# EAGLE design joystikfix (EAGLE 8.2.0)
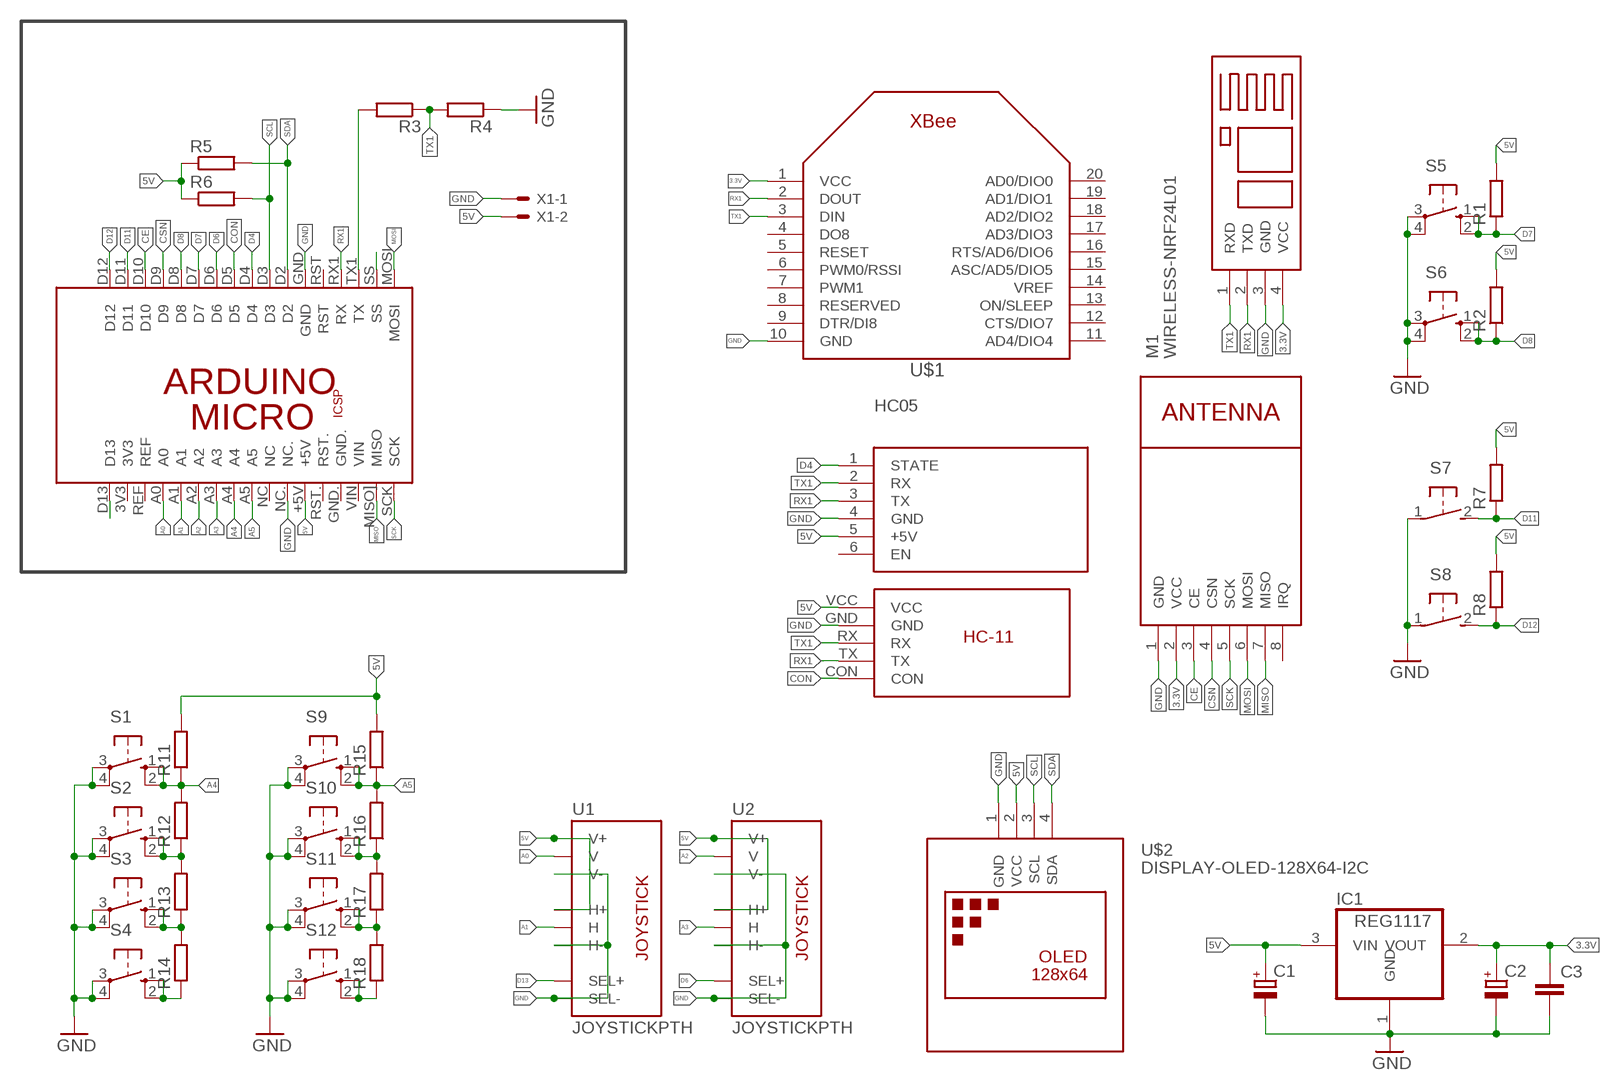
[diagram p0: schematic, sheet 1]

## Parts
C1  CPOL-EUA/3216-18W  [A/3216-18W]
C2  CPOL-EUA/3216-18W  [A/3216-18W]
C3  C-EUC0805K  [C0805K]
HC05  WIRELESS-BLUETOOTH-HC-05  [WIRELESS-BLUETOOTH-HC-05]
HM10  BLUETOOTH  [BLUETOOTH]
IC1  REG1117  [SOT223]
M1  WIRELESS-NRF24L01  [WIRELESS-NRF24L01]
PCB1  ARDUINO_MICRO  [ARDUINO_MICRO]
R1  R-EU_M0805  [M0805]
R2  R-EU_M0805  [M0805]
R3  R-EU_M0805  [M0805]
R4  R-EU_M0805  [M0805]
R5  R-EU_M0805  [M0805]
R6  R-EU_M0805  [M0805]
R7  R-EU_M0805  [M0805]
R8  R-EU_M0805  [M0805]
R11  R-EU_M0805  [M0805]
R12  R-EU_M0805  [M0805]
R13  R-EU_M0805  [M0805]
R14  R-EU_M0805  [M0805]
R15  R-EU_M0805  [M0805]
R16  R-EU_M0805  [M0805]
R17  R-EU_M0805  [M0805]
R18  R-EU_M0805  [M0805]
S1  40-XX  [B3F-40XX]
S2  40-XX  [B3F-40XX]
S3  40-XX  [B3F-40XX]
S4  40-XX  [B3F-40XX]
S5  10-XX  [B3F-10XX]
S6  10-XX  [B3F-10XX]
S7  31-XX  [B3F-31XX]
S8  31-XX  [B3F-31XX]
S9  40-XX  [B3F-40XX]
S10  40-XX  [B3F-40XX]
S11  40-XX  [B3F-40XX]
S12  40-XX  [B3F-40XX]
U1  JOYSTICKPTH  [JOYSTICK]
U2  JOYSTICKPTH  [JOYSTICK]
U$1  XBEE  [XBEE]
U$2  DISPLAY-OLED-128X64-I2C  [DISPLAY-OLED-128X64-I2C]
U$3  HC-11  [HC-11]
X1  22-23-2021  [22-23-2021]

## Nets
3.3V: C2.+ C3.1 HM10.4(VCC) IC1.2(VOUT) M1.2(VCC) U$1.1(VCC)
5V: C1.+ HC05.5(+5V) IC1.3(VIN) PCB1.+5V R1.2 R2.2 R5.1 R6.1 R7.2 R8.2 R11.2 R15.2 U1.H1(H+) U1.V1(V+) U2.H1(H+) U2.V1(V+) U$2.2(VCC) U$3.VCC X1.2
A0: PCB1.A0 U1.V2(V)
A1: PCB1.A1 U1.H2(H)
A2: PCB1.A2 U2.V2(V)
A3: PCB1.A3 U2.H2(H)
A4: PCB1.A4 R11.1 R12.2 S1.1(S) S1.2(S1)
A5: PCB1.A5 R15.1 R16.2 S9.1(S) S9.2(S1)
CE: M1.3(CE) PCB1.D10
CON: PCB1.D5 U$3.CON
CSN: M1.4(CSN) PCB1.D9
D4: HC05.1(STATE) PCB1.D4
D6: PCB1.D6 U2.B1A(SEL+)
D7: PCB1.D7 R1.1 S5.1(S) S5.2(S1)
D8: PCB1.D8 R2.1 S6.1(S) S6.2(S1)
D11: PCB1.D11 R7.1 S7.2(S)
D12: PCB1.D12 R8.1 S8.2(S)
D13: PCB1.D13 U1.B1A(SEL+)
GND: C1.- C2.- C3.2 HC05.4(GND) HM10.3(GND) IC1.1(GND) M1.1(GND) PCB1.GND PCB1.NC. R4.1 S1.3(P) S1.4(P1) S2.3(P) S2.4(P1) S3.3(P) S3.4(P1) S4.3(P) S4.4(P1) S5.3(P) S5.4(P1) S6.3(P) S6.4(P1) S7.1(P) S8.1(P) S9.3(P) S9.4(P1) S10.3(P) S10.4(P1) S11.3(P) S11.4(P1) S12.3(P) S12.4(P1) U1.B2A(SEL-) U1.H3(H-) U1.V3(V-) U2.B2A(SEL-) U2.H3(H-) U2.V3(V-) U$1.10(GND) U$2.1(GND) U$3.GND X1.1
MISO: M1.7(MISO) PCB1.MISO](MISO)
MOSI: M1.6(MOSI) PCB1.MOSI
N$1: PCB1.TX1(TX) R3.2
N$5: PCB1.SS
N$16: R12.1 R13.2 S2.1(S) S2.2(S1)
N$17: R13.1 R14.2 S3.1(S) S3.2(S1)
N$25: R14.1 S4.1(S) S4.2(S1)
N$27: R16.1 R17.2 S10.1(S) S10.2(S1)
N$28: R17.1 R18.2 S11.1(S) S11.2(S1)
N$29: R18.1 S12.1(S) S12.2(S1)
RX1: HC05.3(TX) HM10.2(TXD) PCB1.RX1(RX) U$1.2(DOUT) U$3.TX
SCK: M1.5(SCK) PCB1.SCK
SCL: PCB1.D3 R6.2 U$2.3(SCL)
SDA: PCB1.D2 R5.2 U$2.4(SDA)
TX1: HC05.2(RX) HM10.1(RXD) R3.1 R4.2 U$1.3(DIN) U$3.RX
Unconnected: HC05.6(EN) M1.8(IRQ) PCB1.3V3 PCB1.GND. PCB1.NC PCB1.REF PCB1.RST PCB1.RST. PCB1.VIN U$1.4(DO8) U$1.5(RESET) U$1.6(PWM0/RSSI) U$1.7(PWM1) U$1.8(RESERVED) U$1.9(DTR/DI8) U$1.11(AD4/DIO4) U$1.12(CTS/DIO7) U$1.13(ON/SLEEP) U$1.14(VREF) U$1.15(ASC/AD5/DIO5) U$1.16(RTS/AD6/DIO6) U$1.17(AD3/DIO3) U$1.18(AD2/DIO2) U$1.19(AD1/DIO1) U$1.20(AD0/DIO0)

## Library data of the parts
C1 C2 = rcl:CPOL-EU: POLARIZED CAPACITOR, European symbol
C3 = rcl:C-EU: CAPACITOR, European symbol
HC05 = diy-modules:WIRELESS-BLUETOOTH-HC-05: Bluetooth Transceiver Module based on HC-05 board Tutorial is available here: https://arduino-info.wikispaces.com/BlueTooth-HC05-HC06-Modules-How-To Click here to find device on ebay.com <http://www.ebay.com/sch/hc-05+module+rs232>
HM10 = Bluetooth:BLUETOOTH
IC1 = burr-brown:REG1117: 800mA and 1A Low Dropout (LDO) Positive Regulator 1.8V, 2.5V, 2.85V, 3.3V, 5V, and Adj; MPN: REG1117; OC_FARNELL: 1097566; OC_NEWARK: 14P6981
M1 = diy-modules:WIRELESS-NRF24L01: 2.4 GHz Wireless Module based on NRF24L01 chip More details available here: http://www.electrodragon.com/w/NRF24L01 Click here to find device on ebay.com <http://www.ebay.com/sch/nrf24l01+arduino>
PCB1 = E14_Arduino_revC:ARDUINO_MICRO: Device for representing an Arduino Micro board with a footprint in an EAGLE design. Created by Dave Young for Element14. More EAGLE documentation at: http://www.element14.com/community/community/knode/cadsoft_eagle
R1-R8 R11-R18 = rcl:R-EU_: RESISTOR, European symbol
S1-S4 S9-S12 = switch-omron:40-XX: OMRON SWITCH; MF: OMRON COMPONENTS USA; MPN: B3F-4000; OC_FARNELL: 176434; OC_NEWARK: 36K3105
S5 S6 = switch-omron:10-XX: OMRON SWITCH; MPN: B3F-1000; OC_FARNELL: 176432; OC_NEWARK: 36M3542
S7 S8 = switch-omron:31-XX: OMRON SWITCH; MPN: B3F-3100; OC_FARNELL: 959704; OC_NEWARK: 36M3582
U1 U2 = adafruit:JOYSTICK: Thumb Joystick Joystick commonly found in PS2 controllers. Two pots and a select switch. Adapted from Sparkfun Library (but for more common 6mm switch sticks)
U$1 = adafruit:XBEE
U$2 = diy-modules:DISPLAY-OLED-128X64-I2C: 128x64 Dot Matrix OLED Module based on SSD1306 chip Variant with I2C interface More details available here: http://www.instructables.com/id/Monochrome-096-i2c-OLED-display-with-arduino-SSD13/ SSD1306 datasheet: https://cdn-shop.adafruit.com/datasheets/SSD1306.pdf Click here to find device on ebay.com <http://www.ebay.com/sch/oled+display+128x64+iic> Note: There are two variants: I2C and SPI. Search for the proper version.
U$3 = HC-11:HC-11
X1 = con-molex:22-23-2021: .100" (2.54mm) Center Header - 2 Pin; MF: MOLEX; MPN: 22-23-2021; OC_FARNELL: 1462926; OC_NEWARK: 25C3832

## Board
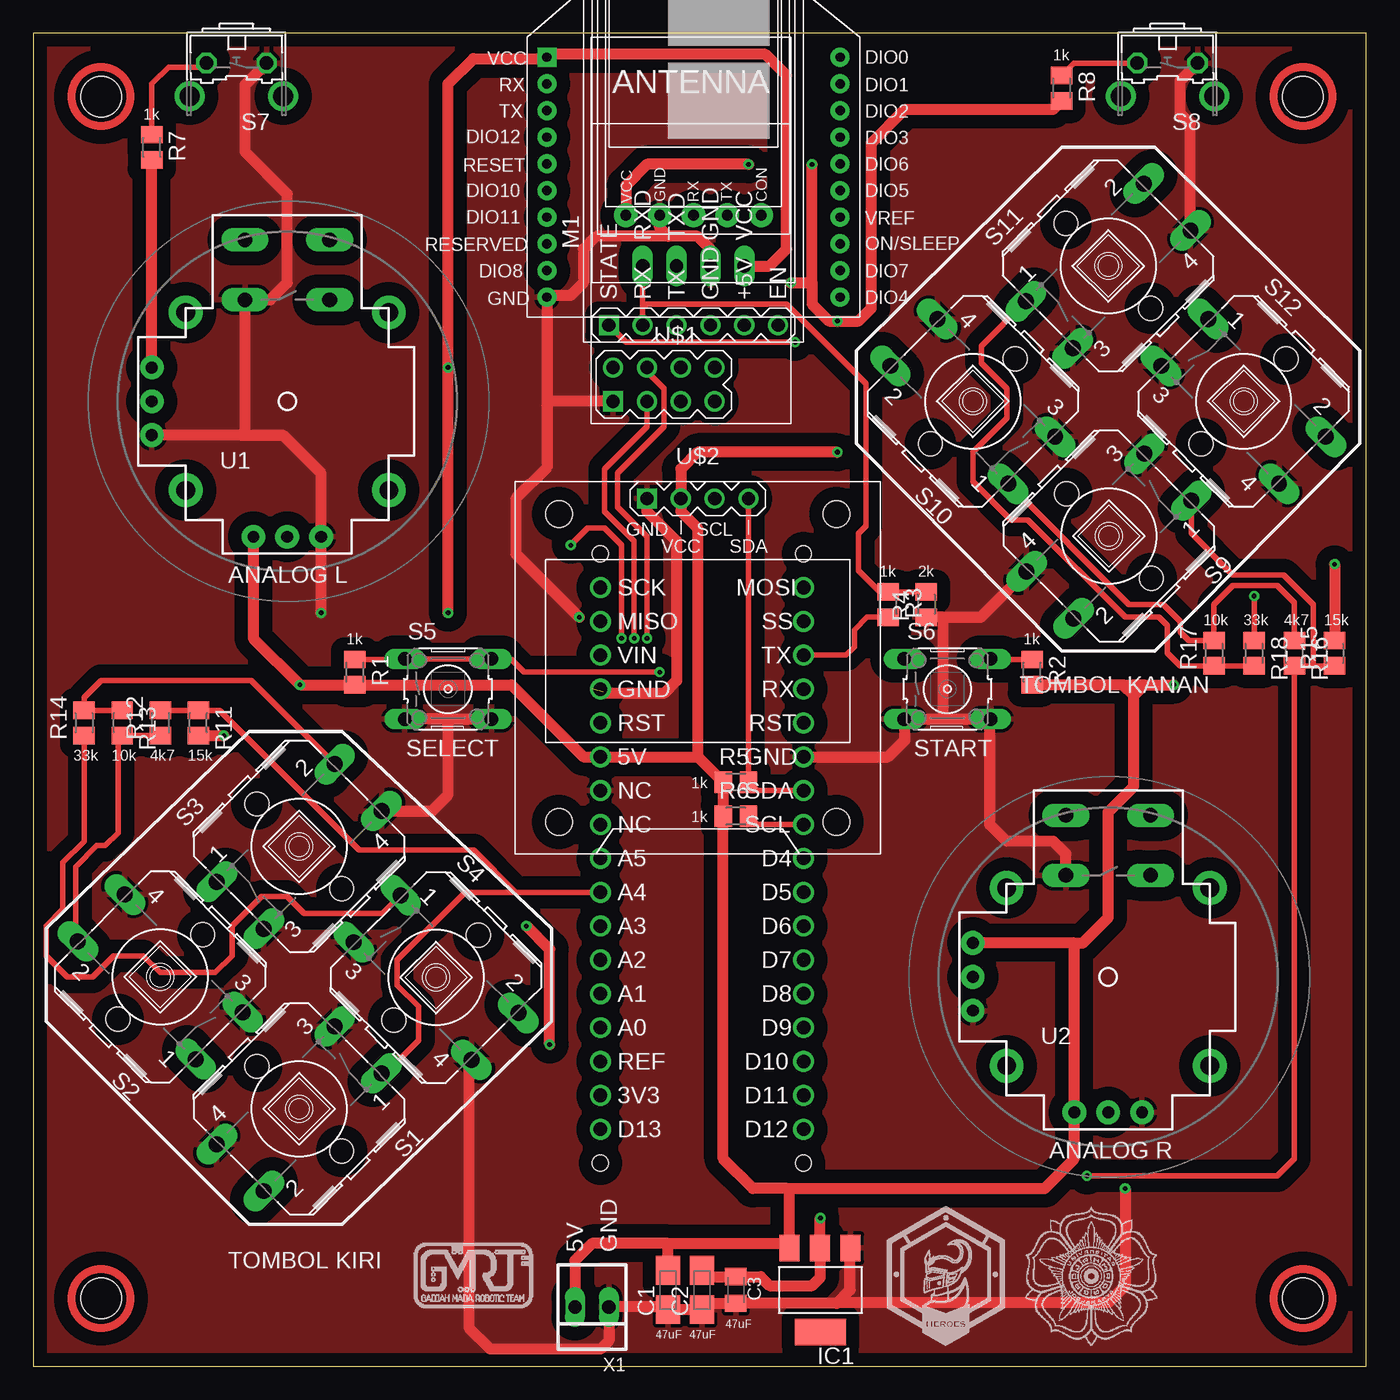
[diagram p1: board, top side]
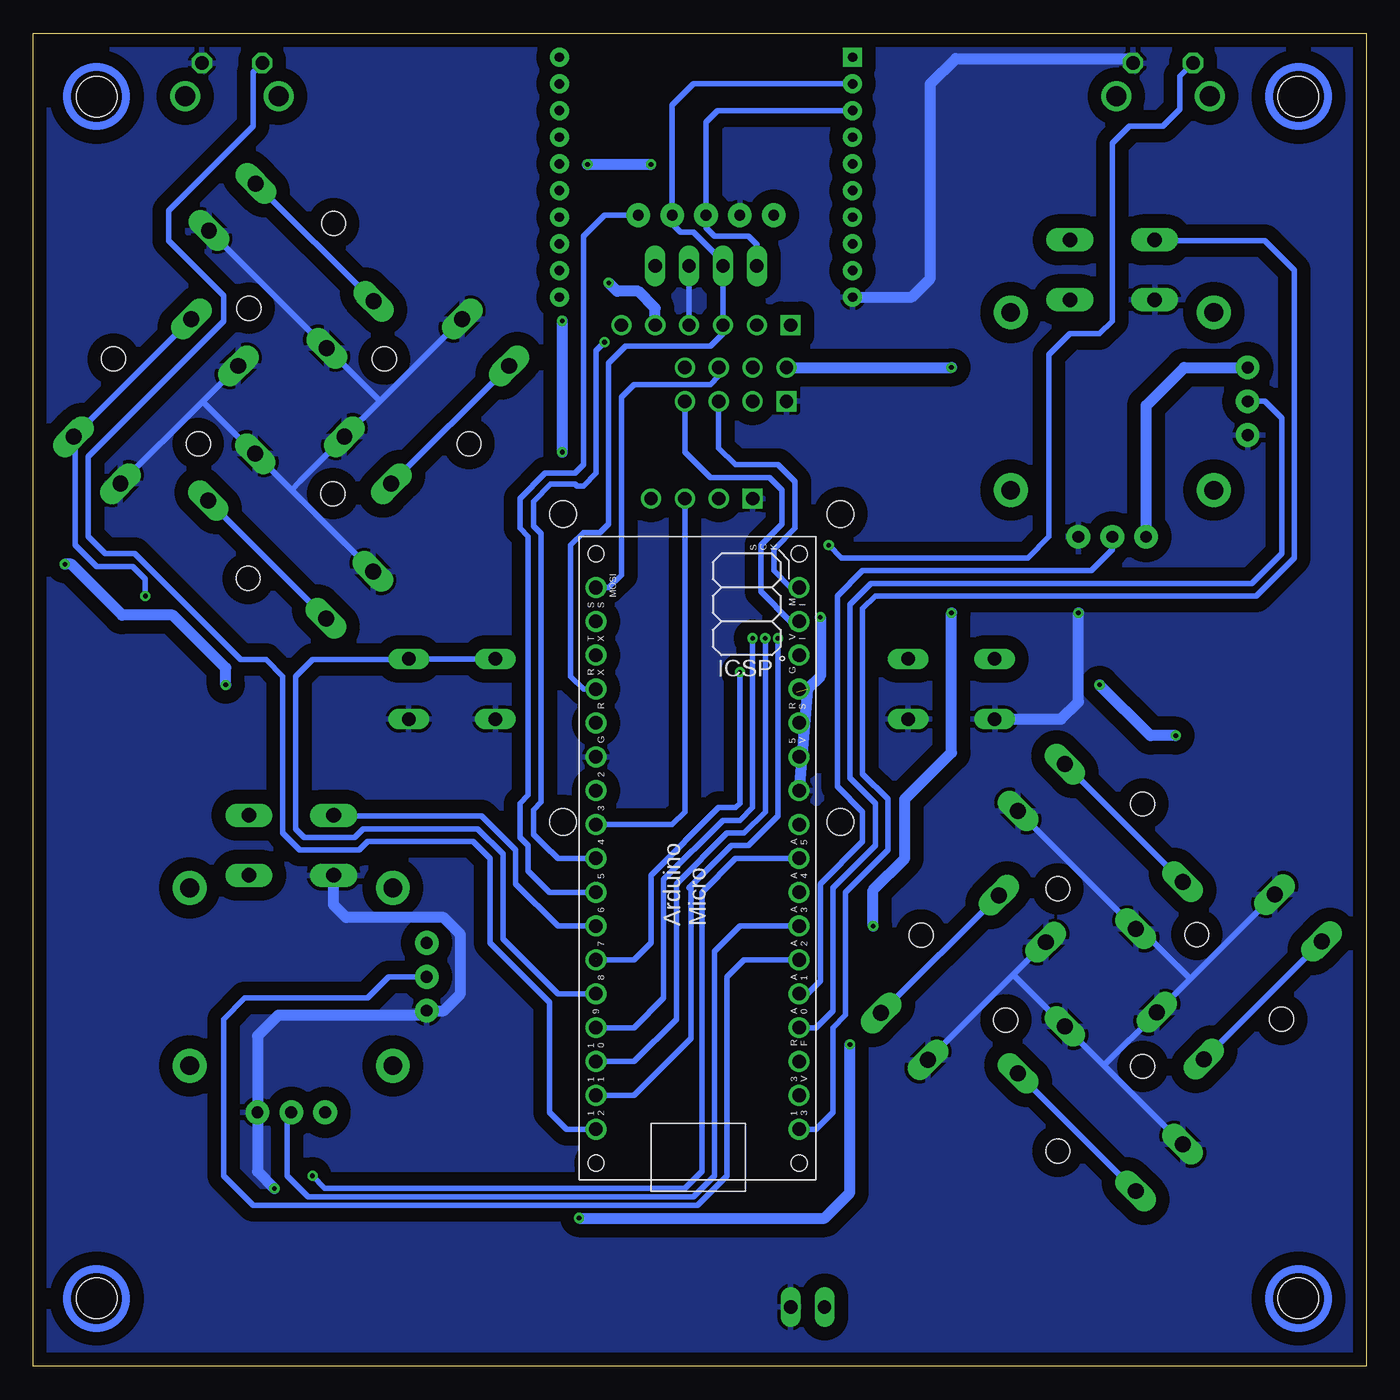
[diagram p2: board, bottom side, seen from below]

Size 100 x 100 mm. Coordinates in mm from the lower left corner, seen from the top.
Outline: 0,0 100,0 100,100 0,100 0,0
Copper layers (1*16): Top 0.035mm / dielectric 1.5mm / Bottom 0.035mm
Design rules "default": minimum track width 6mil, minimum drill 0.35mm, track to track 6mil, track to pad 6mil, pad to pad 6mil, via to via 6mil, smd to smd 6mil, copper to edge 40mil, drill to drill 6mil, minimum pad ring 10mil, minimum via ring 8mil, stop-mask expansion 4mil, vias tented up to drill 0mil, thermal gap 10mil

### Footprints (pad centres in the part's own frame; a part is rotated, then mirrored left to right if it is on the bottom)
A/3216-18W = smd 2.15 x 1.8: + 1.475,0; - -1.475,0
C0805K = smd 1.3 x 1.6: 1 -1,0; 2 1,0
WIRELESS-BLUETOOTH-HC-05 = drill 1 square: 1 -6.35,-17.145 | drill 1: 2 -3.81,-17.145; 3 -1.27,-17.145; 4 1.27,-17.145; 5 3.81,-17.145; 6 6.35,-17.145
BLUETOOTH = drill 1 pad 1.549 long: 1 -6.35,3.81; 2 -6.35,1.27; 3 -6.35,-1.27; 4 -6.35,-3.81
SOT223 = smd 1.499 x 2.007: 1 -2.261,-3.15; 2 0.025,-3.15; 3 2.311,-3.15 | smd 3.81 x 2.007: 4 0,3.15
WIRELESS-NRF24L01 = drill 1 square: 1 -12.7,6.35 | drill 1: 2 -10.16,6.35; 3 -12.7,3.81; 4 -10.16,3.81; 5 -12.7,1.27; 6 -10.16,1.27; 7 -12.7,-1.27; 8 -10.16,-1.27
ARDUINO_MICRO = drill 1.016 pad 1.575: 3V3 6.35,1.27; +5V 31.75,1.27; A0 11.43,1.27; A1 13.97,1.27; A2 16.51,1.27; A3 19.05,1.27; A4 21.59,1.27; A5 24.13,1.27; D2 29.21,16.51; D3 26.67,16.51; D4 24.13,16.51; D5 21.59,16.51; D6 19.05,16.51; D7 16.51,16.51; D8 13.97,16.51; D9 11.43,16.51; D10 8.89,16.51; D11 6.35,16.51; D12 3.81,16.51; D13 3.81,1.27; GND 31.75,16.51; GND. 36.83,1.27; MISO] 41.91,1.27; MOSI 44.45,16.51; NC 26.67,1.27; NC. 29.21,1.27; REF 8.89,1.27; RST 34.29,16.51; RST. 34.29,1.27; RX1 36.83,16.51; SCK 44.45,1.27; SS 41.91,16.51; TX1 39.37,16.51; VIN 39.37,1.27 | hole 1.2: 1.27,1.27; 1.27,16.51; 46.99,16.51; 46.99,1.27
M0805 = smd 1.3 x 1.6: 1 -0.95,0; 2 0.95,0
B3F-40XX = drill 1.194 long: 1 -6.248,2.489; 2 6.248,2.489; 3 -6.248,-2.489; 4 6.248,-2.489 | hole 1.803: 0,-4.496; 0,4.496
B3F-10XX = drill 1.016 long: 1 -3.251,2.261; 2 3.251,2.261; 3 -3.251,-2.261; 4 3.251,-2.261
B3F-31XX = drill 1.016 octagon: 1 -2.261,-1.245; 2 2.261,-1.245 | drill 1.499 pad 2.159: 3 -3.505,1.245; 4 3.505,1.245
JOYSTICK = drill 1.1 pad 1.778 long: B1A -3.175,12.12; B1B 3.175,12.12; B2A -3.175,7.62; B2B 3.175,7.62 | drill 0.889 pad 1.778: H1 -2.54,-10.16; H2 0,-10.16; H3 2.54,-10.16; V1 -10.16,2.54; V2 -10.16,0; V3 -10.16,-2.54 | drill 1.397 pad 2.54: MOUNT1 -7.62,6.668; MOUNT2 -7.62,-6.668; MOUNT3 7.62,-6.668; MOUNT4 7.62,6.668
XBEE = drill 0.7 pad 1.422 square: 1 -11,5.5 | drill 0.7 pad 1.422: 2 -11,3.5; 3 -11,1.5; 4 -11,-0.5; 5 -11,-2.5; 6 -11,-4.5; 7 -11,-6.5; 8 -11,-8.5; 9 -11,-10.5; 10 -11,-12.5; 11 11,-12.5; 12 11,-10.5; 13 11,-8.5; 14 11,-6.5; 15 11,-4.5; 16 11,-2.5; 17 11,-0.5; 18 11,1.5; 19 11,3.5; 20 11,5.5
DISPLAY-OLED-128X64-I2C = drill 1 square: 1 -3.81,12.7 | drill 1: 2 -1.27,12.7; 3 1.27,12.7; 4 3.81,12.7 | hole 2: -10.414,11.557; 10.414,11.557; 10.414,-11.557; -10.414,-11.557
HC-11 = drill 0.8 pad 1.778: CON -17.78,-5.08; GND -17.78,2.54; RX -17.78,0; TX -17.78,-2.54; VCC -17.78,5.08
HOLE-3MM = hole 3.05: 0,0
22-23-2021 = drill 1 long: 1 -1.27,0; 2 1.27,0

### Placement (x,y rotation side)
C1  47.62,5.71 90 top
C2  50.16,5.71 90 top
C3  52.7,5.71 270 top
HC05  49.53,95.25 0 top
HM10  49.53,88.9 90 top
IC1  59.05,5.71 180 top
M1  49.85,85.09 90 top
PCB1  41.27,13.97 90 bottom
R1  24.13,52.07 270 top
R2  74.93,52.07 270 top
R3  64.14,57.15 270 top
R4  66.99,57.15 90 top
R5  52.7,43.81 0 top
R6  52.7,41.27 0 top
R7  8.89,91.44 270 top
R8  77.15,95.89 270 top
R11  12.38,48.26 270 top
R12  9.53,48.26 90 top
R13  6.67,48.26 270 top
R14  3.81,48.26 90 top
R15  97.63,53.5 90 top
R16  94.61,53.5 270 top
R17  88.58,53.5 90 top
R18  91.6,53.5 270 top
S1  19.95,19.31 225 top
S2  9.53,29.21 135 top
S3  19.95,39 45 top
S4  30.22,29.16 315 top
S5  31.12,50.8 0 top
S6  68.58,50.8 0 top
S7  15.24,96.52 180 top
S8  85.09,96.52 180 top
S9  80.7,62.28 225 top
S10  70.48,72.39 135 top
S11  80.64,82.55 45 top
S12  90.81,72.39 315 top
U1  19.05,72.39 0 top
U2  80.64,29.21 0 top
U$1  49.53,92.71 0 top
U$2  49.85,52.39 0 top
U$3  49.53,104.14 90 top
U$4  [HOLE-3MM]  5.08,95.25 0 top
U$5  [HOLE-3MM]  5.08,5.08 0 top
U$6  [HOLE-3MM]  95.25,5.08 0 top
U$7  [HOLE-3MM]  95.25,95.25 0 top
X1  41.91,4.45 180 top

### Tracks (layer width: path | path; a pad name or v marks a point on that pad's centre or on a via)
3.3V  (via drill 0.35)
  Top 0.813: C2.+ 50.64,6.71 C3.1 54.56,6.71 55.25,6.03 58.42,6.03 59.06,6.67 59.06,8.84 IC1.2 59.03,11.09 v59.06,11.11 | v31.12,56.52 v31.12,74.93 31.12,96.2 33.02,98.11 38.43,98.11 U$1.1 38.75,98.42 54.93,98.42 56.52,96.84 56.52,83.82 55.25,82.55 HM10.4 | v38.74,24.13 38.74,31.27 v36.99,33.02
  Bottom 0.813: v59.06,11.11 40.64,11.11 38.74,13.02 v38.74,24.13 | v31.12,56.52 31.12,46.04 34.61,42.55 34.61,38.1 36.99,35.72 v36.99,33.02 | M1.2 v31.12,74.93
5V  (via drill 0.35)
  Top 0.813: 47.51,7.3 C1.+ 47.63,9.21 | X1.2 40.64,7.94 41.91,9.21 47.63,9.21 | 47.63,9.21 56.4,9.21 IC1.3 56.74,13.13 56.54,13.34 | 56.54,13.34 53.98,13.34 51.75,15.56 R6.1 R5.1 49.85,45.72 | 56.54,13.34 75.88,13.34 78.11,15.56 U2.H1 78.11,31.75 | 78.11,31.75 U2.V1 | 78.11,31.75 78.74,31.75 80.65,33.66 80.65,41.59 82.55,43.5 82.55,50.32 | R2.2 81.76,51.12 | 49.85,45.72 PCB1.+5V 41.28,45.72 35.88,51.12 R1.2 v20,51.12 16.51,54.61 U1.H1 | U1.V1 R7.2 | U$3.VCC 44.45,88.58 46.04,90.17 v53.66,90.17 | R11.2 13.65,47.31 | 13.65,47.31 | 49.85,45.72 49.85,62.86 48.58,64.14 U$2.2 48.58,67.31 49.85,68.58 v60.33,68.58 | 58.42,81.28 v58.42,90.17 | 58.42,81.28 58.42,79.69 59.69,78.42 v60.33,78.42 61.91,78.42 62.87,79.38 62.87,91.76 65.41,94.3 76.52,94.3 R8.2 | v56.83,81.28 58.42,81.28 | 13.65,47.31 v14.29,47.31 | 82.55,50.32 82.55,51.12 | 81.76,51.12 82.55,51.12 | 83.34,51.12 82.55,51.12 | 83.34,51.12 v85.57,51.12 | v97.63,60.17 R15.2 | 82.55,50.32 83.34,51.12 | 82.55,50.32 81.76,51.12
  Bottom 0.813: U1.H1 16.51,72.07 13.65,74.93 U1.V1 | HC05.5 53.34,79.38 54.61,80.64 56.2,80.64 v56.83,81.28 | v60.33,78.42 v60.33,68.58 | v58.42,90.17 v53.66,90.17 | v14.29,47.31 16.19,47.31 v20,51.12 | v85.57,51.12 85.57,52.39 89.54,56.36 93.35,56.36 97.16,60.17 v97.63,60.17
A0
  Bottom 0.406: U1.V2 7.62,72.39 6.35,71.12 6.35,60.96 8.57,58.74 37.15,58.74 38.74,57.15 38.74,44.13 36.83,42.23 36.83,39.05 40.01,35.88 40.01,26.67 41.28,25.4 PCB1.A0
A1
  Bottom 0.406: U1.H2 19.05,61.28 20.64,59.69 37.78,59.69 39.69,57.78 39.69,43.5 37.78,41.59 37.78,39.37 40.96,36.2 40.96,28.89 41.91,27.94 PCB1.A1
A2
  Bottom 0.406: PCB1.A2 46.67,30.48 47.94,29.21 47.94,14.29 50.17,12.06 83.5,12.06 85.73,14.29 85.73,26.04 84.14,27.62 74.93,27.62 73.34,29.21 U2.V2
A3
  Bottom 0.406: U2.H2 80.96,18.73 80.96,14.29 79.38,12.7 50.48,12.7 48.9,14.29 48.9,31.11 46.99,33.02 PCB1.A3
A4
  Top 0.406: R12.2 R11.1 13.97,49.21 24.45,38.73 33.02,38.73 36.2,35.56 | 36.2,35.56 PCB1.A4 | 36.2,35.56 32.39,35.56 27.31,30.48 27.31,28.57 28.89,26.99 28.89,24.45 27.62,23.18 27.33,23.18 S1.1
  Bottom 0.406: S1.1 S1.2
A5  (via drill 0.35)
  Top 0.406: v79.06,14.29 93.35,14.29 94.62,15.56 R16.2 95.89,52.55 | 95.89,52.55 R15.1 | S9.1 86.88,62.51 90.01,59.37 93.82,59.37 96.04,57.15 96.04,52.71 95.89,52.55
  Bottom 0.406: PCB1.A5 47.31,38.1 49.85,35.56 49.85,14.61 51.12,13.34 78.13,13.34 79.06,14.27 v79.06,14.29 | S9.2 S9.1
CE  (via drill 0.35)
  Top 0.406: M1.3 46.04,70.48 42.86,67.31 42.86,64.14 45.09,61.91 v45.09,54.61
  Bottom 0.406: v45.09,54.61 45.09,41.59 46.67,40.01 47.94,40.01 51.75,36.2 51.75,26.04 54.93,22.86 PCB1.D10
CON
  Bottom 0.406: PCB1.D5 61.28,35.56 62.87,37.15 62.87,39.05 63.5,39.69 63.5,42.23 62.87,42.86 62.87,62.23 63.5,62.87 63.5,65.09 61.6,66.99 59.37,66.99 58.74,67.63 58.74,84.77 57.15,86.36 U$3.CON
CSN  (via drill 0.35)
  Top 0.406: M1.4 46.04,74.61 47.31,73.34 47.31,70.48 43.82,66.99 43.82,64.45 46.04,62.23 v46.04,54.61
  Bottom 0.406: v46.04,54.61 46.04,41.91 46.99,40.96 48.26,40.96 52.71,36.51 52.71,27.62 54.93,25.4 PCB1.D9
D4  (via drill 0.35)
  Top 0.406: v57.15,76.83 44.45,76.83 HC05.1
  Bottom 0.406: v57.15,76.83 57.79,76.2 57.79,66.99 58.74,66.04 59.22,66.04 59.34,66.16 61.18,66.16 62.48,64.86 62.48,63.02 61.91,62.46 61.91,42.32 62.48,41.75 62.48,39.91 61.18,38.61 61.15,38.61 60.64,38.1 PCB1.D4
D6
  Bottom 0.406: PCB1.D6 60.64,33.02 63.82,36.2 63.82,38.73 66.36,41.27 77.42,41.27 U2.B1A
D7  (via drill 0.35)  (1 unrouted)
  Top 0.406: R1.1 27.82,53.02 S5.1 S5.2 34.4,53.02 35.88,53.02 36.83,52.07 v46.99,52.07
  Bottom 0.406: v46.99,52.07 46.99,42.23 47.31,41.91 48.58,41.91 53.66,36.83 53.66,31.75 54.93,30.48 PCB1.D7
D8
  Top 0.406: R2.1 71.87,53.02 S6.2
  Bottom 0.406: PCB1.D8 60.64,27.94 64.77,32.07 64.77,38.42 66.68,40.32 75.25,40.32 75.88,39.69 79.69,39.69 80.33,40.32 80.33,51.75 79.06,53.02 71.87,53.02 S6.2 S6.1
D11  (via drill 0.35)
  Top 0.406: v44.13,54.61 44.13,61.59 42.86,62.87 41.59,62.87 v40.32,61.59 | R7.1 8.89,96.2 10.16,97.47 12.69,97.47 S7.2
  Bottom 0.406: S7.2 13.97,96.77 13.97,94.3 15.24,93.03 17.78,93.03 19.05,91.76 19.05,78.42 20,77.47 22.23,77.47 23.81,75.88 23.81,62.23 25.4,60.64 39.37,60.64 v40.32,61.59 | 50.8,35.88 50.64,36.04 | 50.64,36.04 47.63,39.05 46.36,39.05 44.13,41.27 v44.13,54.61 | 50.64,36.04 50.64,24.61 54.93,20.32 PCB1.D11
D12
  Top 0.406: S8.2 78.08,97.77 R8.1
  Bottom 0.406: PCB1.D12 60.01,17.78 61.28,19.05 61.28,27.3 65.72,31.75 65.72,38.1 66.99,39.37 74.93,39.37 75.57,38.73 80.01,38.73 81.28,40.01 81.28,51.75 82.55,53.02 84.46,53.02 92.39,60.96 94.62,60.96 95.89,62.23 95.89,68.26 85.73,78.42 85.73,80.33 89.85,84.45 89.85,86.68 83.5,93.03 83.5,97.09 S8.2
D13
  Bottom 0.406: U1.B1A 15.82,84.45 7.62,84.45 5.4,82.23 5.4,60.64 8.26,57.78 36.83,57.78 37.78,56.83 37.78,44.45 35.88,42.55 35.88,38.73 39.05,35.56 39.05,26.35 40.01,25.4 40.01,19.05 41.28,17.78 PCB1.D13
GND  (via drill 0.35)  (1 unrouted)
  Top 0.813: 60.33,4.76 61.28,5.71 61.28,8.83 IC1.1 | 15.56,69.85 U1.V3 | 15.56,69.85 18.73,69.85 21.59,66.99 U1.H3 v21.59,56.52 | 15.56,69.85 15.88,70.17 U1.B2A 17.78,80.01 19.05,81.28 19.05,87.95 15.88,91.12 15.88,96.14 S7.1 | HM10.3 50.8,83.82 49.85,84.77 47.63,84.77 | 47.63,84.77 46.99,85.41 U$3.GND | 47.63,84.77 42.23,84.77 41.28,83.82 41.28,81.28 40.32,80.33 38.65,80.33 U$1.10 38.53,72.07 | 38.53,72.07 38.53,67.42 36.2,65.09 36.2,60.96 v40.96,56.2 | 31.43,48.54 S5.3 | 31.43,48.54 S5.4 | S3.4 29.91,41.66 31.12,42.86 31.12,48.22 31.43,48.54 | U$2.1 46.04,64.14 48.26,61.91 48.26,51.44 47.31,50.48 42.86,50.48 42.76,50.58 | v81.92,13.34 81.92,6.03 80.65,4.76 60.33,4.76 | 60.33,4.76 60.28,4.71 C3.2 50.64,4.71 C2.- C1.- 47.42,4.45 X1.1 43.18,1.91 42.55,1.27 34.29,1.27 32.7,2.86 32.7,22.8 S4.4 | U2.B2A 77.47,38.42 76.52,39.37 73.03,39.37 71.76,40.64 71.76,48.46 S6.4 68.26,48.54 | 68.26,48.54 S6.3 65.41,48.46 65.41,46.99 64.14,45.72 PCB1.GND | S9.4 71.09,56.2 68.26,56.2 | S11.4 86.82,93.2 86.04,93.98 86.04,96.46 S8.1 | 38.53,72.07 38.85,72.39 M1.1 | 68.26,48.54 68.26,56.2 | 68.26,56.2 R4.1
  Bottom 0.406: HC05.4 HM10.3 | S4.3 26.5,29.36 | 26.5,29.36 S4.4 | 19.67,22.56 S1.3 26.47,29.36 26.5,29.36 | 19.67,22.56 S1.4 | 13.19,29.07 S2.4 | 13.19,29.07 S2.3 15.7,26.52 19.67,22.56 | 13.19,29.07 16.94,32.82 S3.3 S3.4 | S12.3 87.3,72.38 | 87.3,72.38 S12.4 | 87.3,72.38 83.39,68.46 S9.3 80.63,65.74 | S11.4 S11.3 77.96,76.37 73.99,72.4 | 73.99,72.4 S10.4 | 73.99,72.4 S10.3 76.66,69.7 80.01,66.36 80.63,65.74 | 80.63,65.74 S9.4
  Bottom 0.813: U2.B2A 77.47,34.61 76.52,33.66 69.22,33.66 67.95,32.38 67.95,27.94 69.22,26.67 U2.V3 70.8,26.35 81.6,26.35 83.19,24.77 U2.H3 83.19,14.61 v81.92,13.34 | U$1.10 34.09,80.21 32.7,81.6 32.7,96.2 30.8,98.11 17.84,98.11 S7.1 | S5.3 22.9,48.54 21.59,49.85 v21.59,56.52 | v40.96,56.2 40.96,51.75 41.91,50.8 PCB1.NC.
  pour Top (isolate 1.016): 0.32,99.69 0.32,0.32 99.7,0.32 99.7,99.69
  pour Bottom (isolate 1.016): -0.32,99.69 -0.32,0.32 99.7,0.32 99.7,99.69
MISO
  Bottom 0.406: PCB1.MISO] 43.18,55.88 45.4,58.1 45.4,61.59 43.82,63.18 43.82,65.72 44.77,66.67 49.21,66.67 51.12,68.58 M1.7
MOSI
  Bottom 0.406: PCB1.MOSI 56.83,58.42 55.88,59.37 55.88,72.71 54.93,73.66 49.21,73.66 48.58,74.3 M1.6
N$1
  Top 0.406: R3.2 62.55,56.2 61.6,55.24 61.6,53.98 60.96,53.34 PCB1.TX1
N$16
  Top 0.406: R12.1 R13.2 6.35,46.99 6.35,40.01 5.4,39.05 4.76,39.05 3.18,37.47 3.18,32.04 S2.2
  Bottom 0.406: S2.2 S2.1
N$17
  Top 0.406: R13.1 R14.2 3.81,50.16 5.08,51.44 16.35,51.44 S3.2
  Bottom 0.406: S3.1 S3.2
N$25
  Top 0.406: R14.1 3.81,39.37 2.22,37.78 2.22,34.29 0.95,33.02 0.95,30.8 2.54,29.21 4.45,29.21 6.03,30.8 8.26,30.8 9.53,29.53 13.65,29.53 14.92,30.8 14.92,33.02 17.15,35.24 19.05,35.24 20.32,33.97 26.2,33.97 S4.1
  Bottom 0.406: S4.1 S4.2
N$27
  Top 0.406: S10.1 82.2,57.15 84.77,57.15 86.04,55.88 86.04,55.09 86.68,54.45 88.74,54.45 R17.2 88.58,57.15 90.01,58.58 93.35,58.58 94.62,57.31 R16.1
  Bottom 0.406: S10.2 S10.1
N$28
  Top 0.406: S11.1 71.12,76.55 71.12,75.25 73.03,73.34 73.03,71.12 70.49,68.58 70.49,66.36 73.34,63.5 74.61,63.5 81.92,56.2 84.46,56.2 85.09,55.56 85.09,53.5 86.04,52.55 88.74,52.55 R17.1 R18.2
  Bottom 0.406: S11.1 S11.2
N$29  (via drill 0.35)
  Top 0.406: R18.1 v91.6,57.78
  Bottom 0.406: S12.1 S12.2 96.84,69.59 96.84,61.59 95.25,60.01 92.55,60.01 91.6,59.05 v91.6,57.78
RX1
  Bottom 0.406: PCB1.RX1 58.74,50.8 59.69,51.75 59.69,61.59 58.74,62.55 57.47,62.55 56.83,63.18 56.83,75.25 55.56,76.52 49.21,76.52 48.26,77.47 HC05.3 HM10.2 48.26,82.87 50.48,85.09 51.44,85.09 52.07,85.72 U$3.TX 52.07,94.61 50.48,96.21 U$1.2
SCK
  Bottom 0.406: PCB1.SCK 43.18,58.42 44.45,59.69 44.45,61.28 42.86,62.87 42.86,66.36 44.13,67.63 47.31,67.63 48.58,68.9 M1.5
SCL
  Top 0.406: PCB1.D3 54.29,40.64 R6.2
  Bottom 0.406: PCB1.D3 52.07,40.64 51.12,41.59 U$2.3
SDA
  Top 0.406: PCB1.D2 54.29,43.18 R5.2 U$2.4
TX1
  Top 0.406: R4.2 R3.1 63.5,58.1 61.91,59.69 61.91,62.46 62.48,63.02 62.48,73.73 56.52,79.69 45.72,79.69 | 45.72,79.38 HC05.2 | 45.72,79.69 45.72,79.38 | 45.72,79.69 HM10.1 | 46.04,79.69 45.72,79.38
  Bottom 0.406: HM10.1 45.72,84.14 46.36,84.77 48.9,84.77 49.53,85.41 U$3.RX 49.53,93.34 48.67,94.21 U$1.3

### Text on the board
tPlace: VCC | DIO0 | 1k | RX | DIO1 | 1k | TX | DIO2 | DIO12 | DIO3 | RESET | DIO6 | DIO10 | DIO5 | DIO11 | VREF | RESERVED | ON/SLEEP | DIO8 | DIO7 | GND | DIO4 | ANALOG L | 1k | 2k | SCK | MOSI | 10k | 33k | 4k7 | 15k | MISO | SS | 1k | 1k | VIN | TX | GND | RX | TOMBOL KANAN | RST | RST | SELECT | START | 33k | 10k | 4k7 | 15k | 5V | GND | NC | 1k | SDA | 1k | NC | SCL | A5 | D4 | A4 | D5 | A3 | D6 | A2 | D7 | A1 | D8 | A0 | D9 | REF | D10 | 3V3 | D11 | D13 | D12 | ANALOG R | 5V | GND | TOMBOL KIRI | 47uF | 47uF | 47uF